# EAGLE schematic Ammeter (EAGLE 9.2.2)
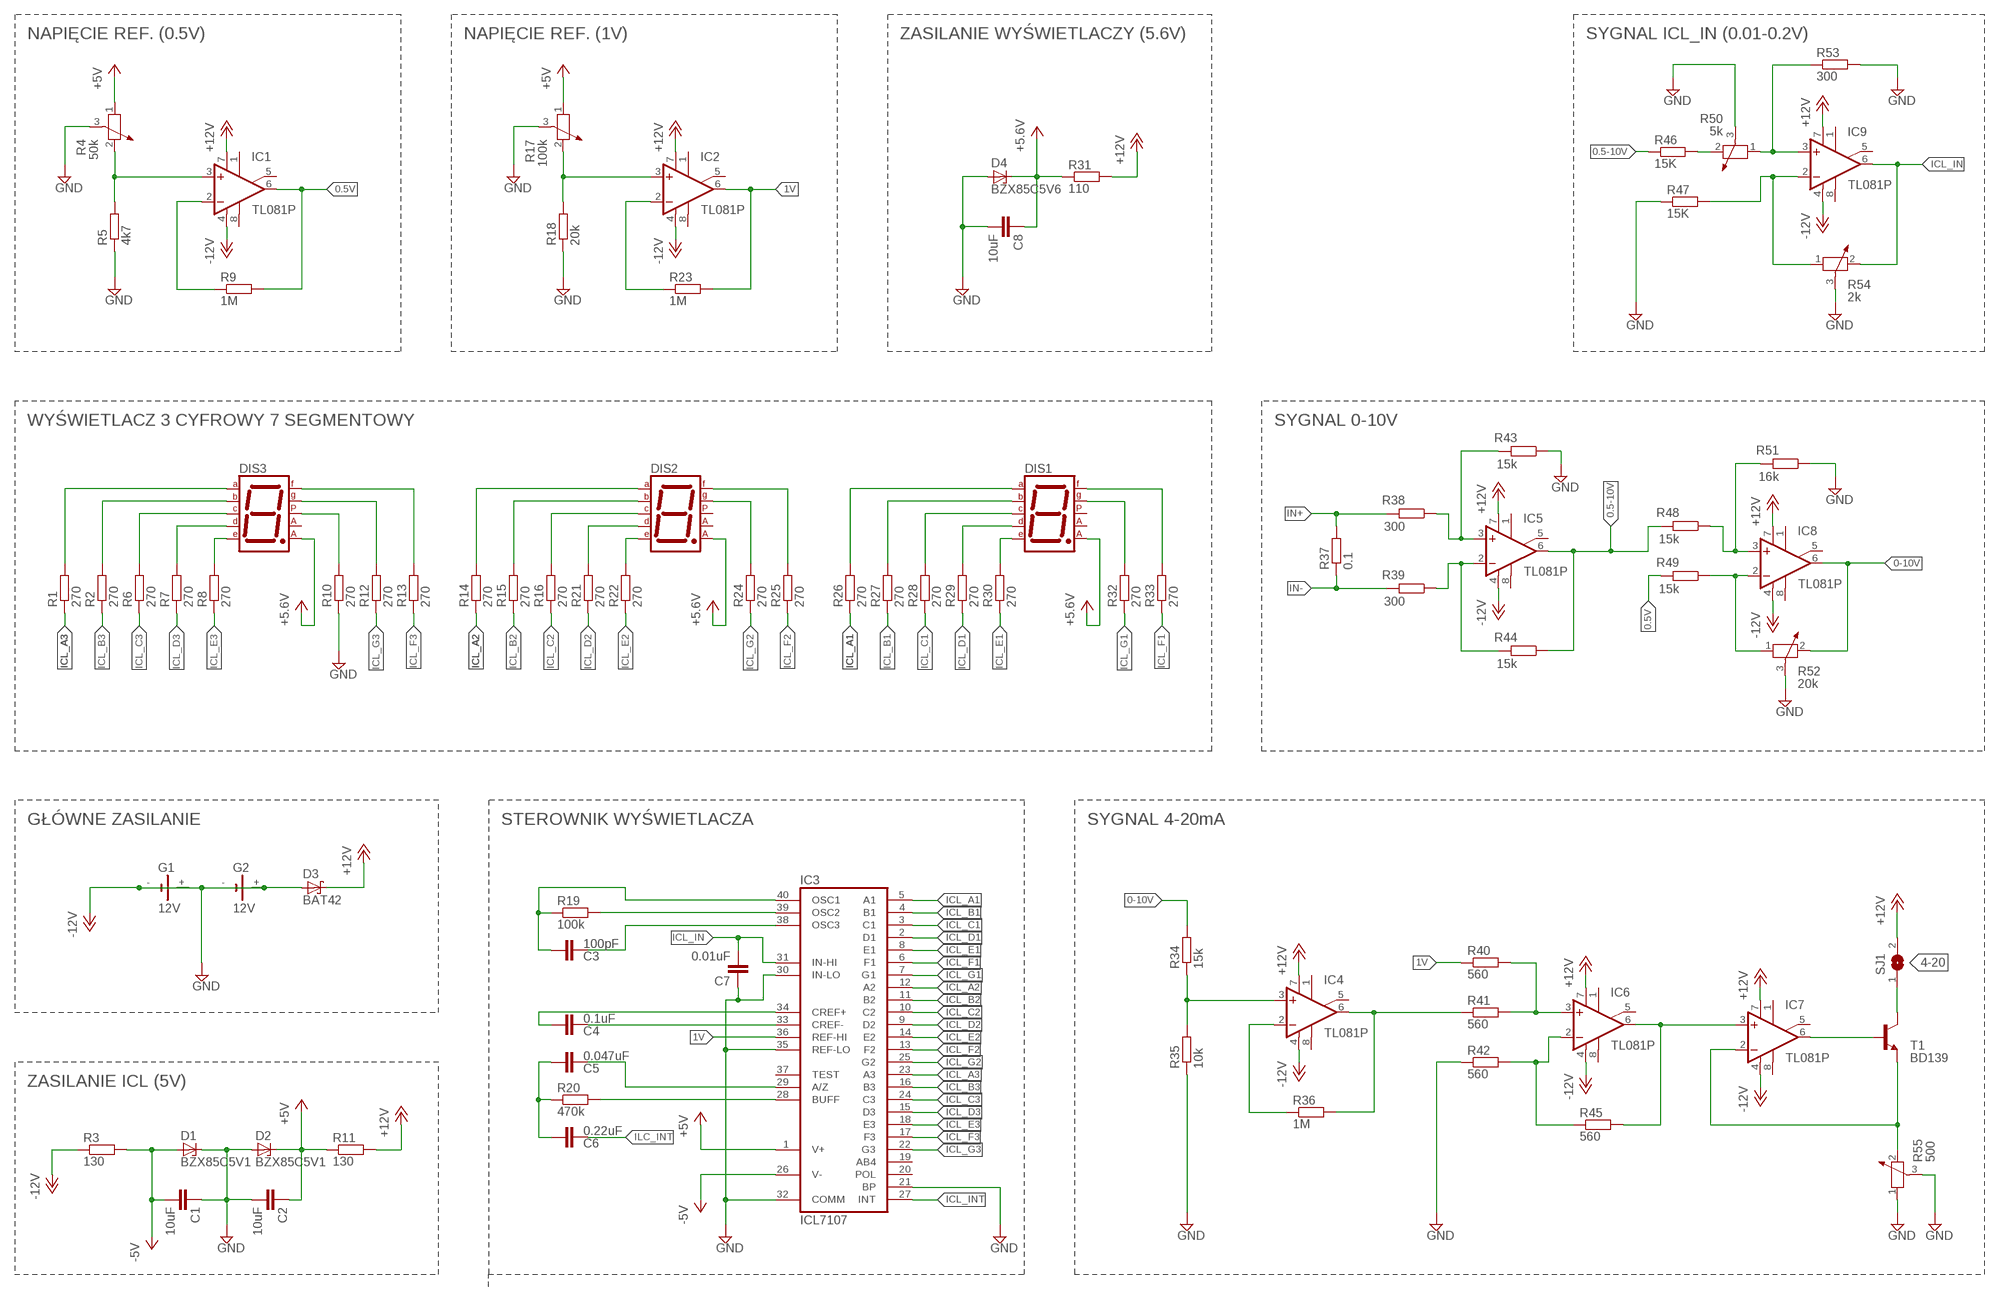
[diagram p0: schematic, sheet 1]

## Parts
C1  10uF  C-EU025-024X044  [C025-024X044]
C2  10uF  C-EU025-024X044  [C025-024X044]
C3  100pF  C-EU025-024X044  [C025-024X044]
C4  0.1uF  C-EU025-024X044  [C025-024X044]
C5  0.047uF  C-EU025-024X044  [C025-024X044]
C6  0.22uF  C-EU025-024X044  [C025-024X044]
C7  0.01uF  C-EU025-024X044  [C025-024X044]
C8  10uF  C-EU025-024X044  [C025-024X044]
D1  BZX85C5V1  BZX85  [DO41Z10]
D2  BZX85C5V1  BZX85  [DO41Z10]
D3  BAT42  [DO35-10]
D4  BZX85C5V6  BZX85  [DO41Z10]
DIS1  7SEG-CA  [7SEG-13]
DIS2  7SEG-CA  [7SEG-13]
DIS3  7SEG-CA  [7SEG-13]
G1  12V  CH291-1220LF  [CH291-1220LF]
G2  12V  CH291-1220LF  [CH291-1220LF]
IC1  TL081P  [DIL08]
IC2  TL081P  [DIL08]
IC3  ICL7107  [DIL40]
IC4  TL081P  [DIL08]
IC5  TL081P  [DIL08]
IC6  TL081P  [DIL08]
IC7  TL081P  [DIL08]
IC8  TL081P  [DIL08]
IC9  TL081P  [DIL08]
R1  270  R-EU_0204/7  [0204/7]
R2  270  R-EU_0204/7  [0204/7]
R3  130  R-EU_0204/7  [0204/7]
R4  50k  POTENTIOMETER_PT_SPIN  [PT-SPIN]
R5  4k7  R-EU_0204/7  [0204/7]
R6  270  R-EU_0204/7  [0204/7]
R7  270  R-EU_0204/7  [0204/7]
R8  270  R-EU_0204/7  [0204/7]
R9  1M  R-EU_0204/7  [0204/7]
R10  270  R-EU_0204/7  [0204/7]
R11  130  R-EU_0204/7  [0204/7]
R12  270  R-EU_0204/7  [0204/7]
R13  270  R-EU_0204/7  [0204/7]
R14  270  R-EU_0204/7  [0204/7]
R15  270  R-EU_0204/7  [0204/7]
R16  270  R-EU_0204/7  [0204/7]
R17  100k  POTENTIOMETER_PT_SPIN  [PT-SPIN]
R18  20k  R-EU_0204/7  [0204/7]
R19  100k  R-EU_0204/7  [0204/7]
R20  470k  R-EU_0204/7  [0204/7]
R21  270  R-EU_0204/7  [0204/7]
R22  270  R-EU_0204/7  [0204/7]
R23  1M  R-EU_0204/7  [0204/7]
R24  270  R-EU_0204/7  [0204/7]
R25  270  R-EU_0204/7  [0204/7]
R26  270  R-EU_0204/7  [0204/7]
R27  270  R-EU_0204/7  [0204/7]
R28  270  R-EU_0204/7  [0204/7]
R29  270  R-EU_0204/7  [0204/7]
R30  270  R-EU_0204/7  [0204/7]
R31  110  R-EU_0204/7  [0204/7]
R32  270  R-EU_0204/7  [0204/7]
R33  270  R-EU_0204/7  [0204/7]
R34  15k  R-EU_0204/7  [0204/7]
R35  10k  R-EU_0204/7  [0204/7]
R36  1M  R-EU_0204/7  [0204/7]
R37  0.1  R-EU_0204/7  [0204/7]
R38  300  R-EU_0204/7  [0204/7]
R39  300  R-EU_0204/7  [0204/7]
R40  560  R-EU_0204/7  [0204/7]
R41  560  R-EU_0204/7  [0204/7]
R42  560  R-EU_0204/7  [0204/7]
R43  15k  R-EU_0204/7  [0204/7]
R44  15k  R-EU_0204/7  [0204/7]
R45  560  R-EU_0204/7  [0204/7]
R46  15K  R-EU_0204/7  [0204/7]
R47  15K  R-EU_0204/7  [0204/7]
R48  15k  R-EU_0204/7  [0204/7]
R49  15k  R-EU_0204/7  [0204/7]
R50  5k  POTENTIOMETER_PT_SPIN  [PT-SPIN]
R51  16k  R-EU_0204/7  [0204/7]
R52  20k  POTENTIOMETER_PT_SPIN  [PT-SPIN]
R53  300  R-EU_0204/7  [0204/7]
R54  2k  POTENTIOMETER_PT_SPIN  [PT-SPIN]
R55  500  POTENTIOMETER_PT_SPIN  [PT-SPIN]
SJ1  SJ  [SJ]
T1  BD139  [TO126]

## Nets
0-10V: IC8.6(OUT) R34.2 R52.2
0.5-10V: IC5.6(OUT) R44.1 R46.1 R48.2
0.5V: IC1.6(OUT) R9.2 R49.2
1V: IC2.6(OUT) IC3.36(REF-HI) R23.2 R40.1
4-20: SJ1.1 T1.2(C)
+5V: C2.1 C8.1 D2.C D4.C DIS1.8(CA2) DIS2.8(CA2) DIS3.8(CA2) IC3.1(V+) R4.1 R11.1 R17.1 R31.1 ; supply symbol labelled +5.6V
+12V: D3.C IC1.7(V+) IC2.7(V+) IC4.7(V+) IC5.7(V+) IC6.7(V+) IC7.7(V+) IC8.7(V+) IC9.7(V+) R11.2 R31.2 SJ1.2
-5V: C1.2 D1.A IC3.26(V-) R3.2
-12V: D3.A G1.- G2.+ IC1.4(V-) IC2.4(V-) IC4.4(V-) IC5.4(V-) IC6.4(V-) IC7.4(V-) IC8.4(V-) IC9.4(V-) R3.1
GND: C1.1 C2.2 C7.1 C8.2 D1.C D2.A D4.A G1.+ G2.- IC3.21(BP) IC3.30(IN-LO) IC3.32(COMM) IC3.35(REF-LO) R4.3 R5.1 R10.1 R17.3 R18.1 R35.1 R42.1 R43.1 R47.1 R50.3 R51.1 R52.3 R53.2 R54.3 R55.1 R55.3
ICL_A1: IC3.5(A1) R26.1
ICL_A2: IC3.12(A2) R14.1
ICL_A3: IC3.23(A3) R1.1
ICL_B1: IC3.4(B1) R27.1
ICL_B2: IC3.11(B2) R15.1
ICL_B3: IC3.16(B3) R2.1
ICL_C1: IC3.3(C1) R28.1
ICL_C2: IC3.10(C2) R16.1
ICL_C3: IC3.24(C3) R6.1
ICL_D1: IC3.2(D1) R29.1
ICL_D2: IC3.9(D2) R21.1
ICL_D3: IC3.15(D3) R7.1
ICL_E1: IC3.8(E1) R30.1
ICL_E2: IC3.14(E2) R22.1
ICL_E3: IC3.18(E3) R8.1
ICL_F1: IC3.6(F1) R33.1
ICL_F2: IC3.13(F2) R25.1
ICL_F3: IC3.17(F3) R13.1
ICL_G1: IC3.7(G1) R32.1
ICL_G2: IC3.25(G2) R24.1
ICL_G3: IC3.22(G3) R12.1
ICL_IN: C7.2 IC3.31(IN-HI) IC9.6(OUT) R54.2
ICL_INT: IC3.27(INT)
ILC_INT: C6.1
IN+: R37.2 R38.2
IN-: R37.1 R39.2
N$1: C3.2 IC3.40(OSC1) R19.1
N$2: IC3.39(OSC2) R19.2
N$3: C3.1 IC3.38(OSC3)
N$4: C4.2 IC3.34(CREF+)
N$5: DIS3.5(DP) R10.2
N$6: C4.1 IC3.33(CREF-)
N$7: IC1.2(-IN) R9.1
N$8: C5.1 IC3.29(A/Z)
N$9: IC3.28(BUFF) R20.2
N$10: C5.2 C6.2 R20.1
N$11: IC2.2(-IN) R23.1
N$12: IC1.3(+IN) R4.2 R5.2
N$13: IC2.3(+IN) R17.2 R18.2
N$14: IC5.3(+IN) R38.1 R43.2
N$15: IC5.2(-IN) R39.1 R44.2
N$16: IC8.2(-IN) R49.1 R52.1
N$17: IC4.3(+IN) R34.1 R35.2
N$18: IC8.3(+IN) R48.1 R51.2
N$19: IC4.2(-IN) R36.1
N$20: IC4.6(OUT) R36.2 R41.1
N$21: IC6.3(+IN) R40.2 R41.2
N$22: IC7.6(OUT) T1.3(B)
N$23: IC6.2(-IN) R42.2 R45.1
N$24: IC6.6(OUT) IC7.3(+IN) R45.2
N$25: IC7.2(-IN) R55.2 T1.1(E)
N$26: DIS1.7(A) R26.2
N$28: DIS1.6(B) R27.2
N$29: DIS1.4(C) R28.2
N$30: DIS1.2(D) R29.2
N$31: DIS1.1(E) R30.2
N$32: DIS1.9(F) R33.2
N$33: DIS2.7(A) R14.2
N$34: DIS1.10(G) R32.2
N$35: DIS2.2(D) R21.2
N$36: DIS2.6(B) R15.2
N$37: DIS2.4(C) R16.2
N$38: DIS2.1(E) R22.2
N$39: DIS2.9(F) R25.2
N$40: DIS2.10(G) R24.2
N$41: DIS3.7(A) R1.2
N$42: DIS3.2(D) R7.2
N$43: DIS3.6(B) R2.2
N$44: DIS3.4(C) R6.2
N$45: DIS3.1(E) R8.2
N$46: DIS3.9(F) R13.2
N$47: DIS3.10(G) R12.2
N$48: R46.2 R50.2
N$49: IC9.3(+IN) R50.1 R53.1
N$51: IC9.2(-IN) R47.2 R54.1
Unconnected: DIS1.3(CA1) DIS1.5(DP) DIS2.3(CA1) DIS2.5(DP) DIS3.3(CA1) IC1.1(ON1) IC1.5(ON2) IC1.8(OPT) IC2.1(ON1) IC2.5(ON2) IC2.8(OPT) IC3.19(AB4) IC3.20(POL) IC3.37(TEST) IC4.1(ON1) IC4.5(ON2) IC4.8(OPT) IC5.1(ON1) IC5.5(ON2) IC5.8(OPT) IC6.1(ON1) IC6.5(ON2) IC6.8(OPT) IC7.1(ON1) IC7.5(ON2) IC7.8(OPT) IC8.1(ON1) IC8.5(ON2) IC8.8(OPT) IC9.1(ON1) IC9.5(ON2) IC9.8(OPT)

## Notes on the sheet
- NAPIĘCIE REF. (0.5V) | NAPIĘCIE REF. (1V) | ZASILANIE WYŚWIETLACZY (5.6V) | SYGNAL ICL_IN (0.01-0.2V)
- WYŚWIETLACZ 3 CYFROWY 7 SEGMENTOWY | SYGNAL 0-10V
- GŁÓWNE ZASILANIE | STEROWNIK WYŚWIETLACZA | SYGNAL 4-20mA
- ZASILANIE ICL (5V)

## Library data of the parts
C1-C8 = resistor:C-EU: CAPACITOR, European symbol
D1 D2 D4 = diode:BZX85: Z DIODE
D3 = diode:BAT42: DIODE barrier diode
DIS1-DIS3 = special:7SEG-CA: 7-segment DISPLAY single anode, 13 mm
G1 G2 = battery:CH291-1220LF: Battery Holder, SMT, 12mm multicomp PART NO. CH291-1220LF Source: Data sheet <http://www.farnell.com/datasheets/1505860.pdf>
IC1 IC2 IC4-IC9 = linear:TL081: OP AMP
IC3 = ICL7107:ICL7107: ICM007; AVAILABILITY: Unavailable; MF: Intersil; MP: ICL7107; PACKAGE: DIP-40 Intersil; PRICE: None
R1-R3 R5-R16 R18-R49 R51 R53 = resistor:R-EU_: RESISTOR, European symbol
R4 R17 R50 R52 R54 R55 = rcl:POTENTIOMETER_: Potentiometer; SPICEMODEL: POT; SPICEPREFIX: X
SJ1 = jumper:SJ: SMD solder JUMPER
T1 = transistor:BD139: NPN TRANSISTOR; SPICEPREFIX: J